# Altium schematic sheet TPS54528.schdoc
size 307 x 144 mm; SheetNumber: 1; SheetTotal: 1
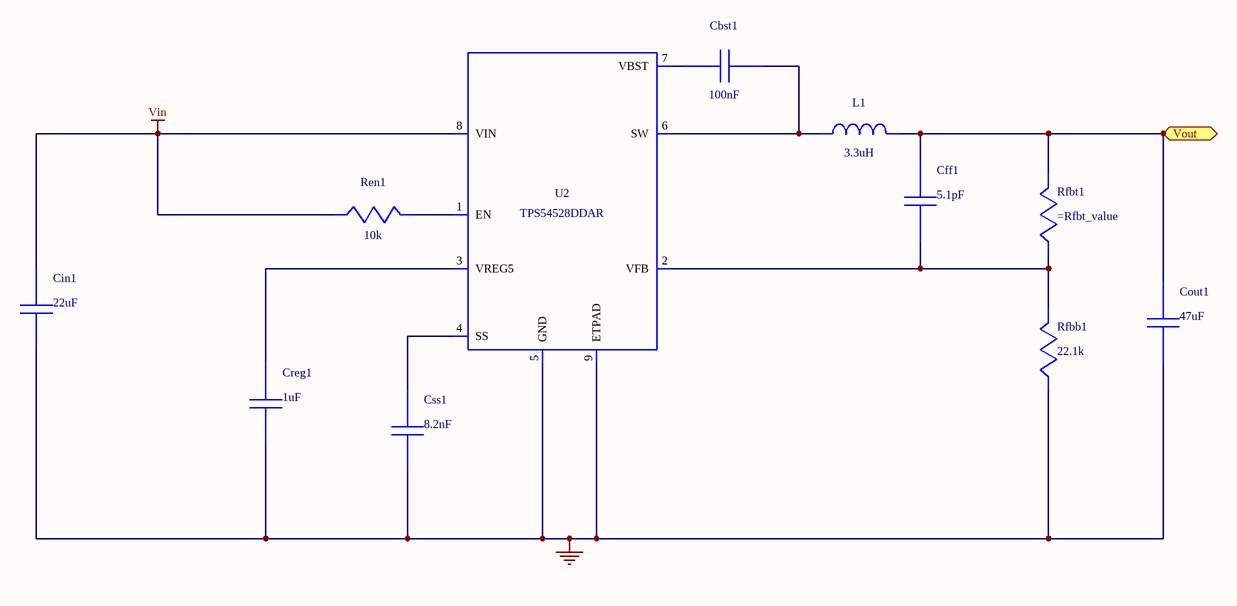
[diagram p0: TPS54528.schdoc]

## Parts
Cbst1  value 100nF  [AXIAL-0.3]  (hidden comment: C1005X5R1A104K)
Cff1  value 5.1pF  [AXIAL-0.3]  (hidden comment: GRM1555C1E5R1CA01D)
Cin1  value 22uF  [AXIAL-0.3]  (hidden comment: GRM32ER61E226KE15L)
Cout1  value 47uF  [AXIAL-0.3]  (hidden comment: GRM31CR61A476KE15L)
Creg1  value 1uF  [AXIAL-0.3]  (hidden comment: C1608X5R1A105K)
Css1  value 8.2nF  [AXIAL-0.3]  (hidden comment: GRM155R71E822KA01D)
L1  value 3.3uH  [Inductor]  (hidden comment: IHLP3232DZER3R3M11)
Ren1  value 10k  [AXIAL-0.3]  (hidden comment: CRCW040210K0FKED)
Rfbb1  value 22.1k  [AXIAL-0.3]  (hidden comment: CRCW040222K1FKED)
Rfbt1  CRCW0402121KFKED  [AXIAL-0.3]  (value not drawn)
U2  TPS54528DDAR  [DDA8_3P1X2P4]

## Ports
Vout (out)

## Nets
GND: Cin1.2 Cout1.2 Creg1.2 Css1.2 Rfbb1.2 U2.5(GND) U2.9(ETPAD)
Vin: Cin1.1 Ren1.2 U2.8(VIN)
Vout: Cff1.1 Cout1.1 L1.2 Rfbt1.1 ; port Vout
NetCbst1_1: Cbst1.1 U2.7(VBST)
NetCbst1_2: Cbst1.2 L1.1 U2.6(SW)
NetCff1_2: Cff1.2 Rfbb1.1 Rfbt1.2 U2.2(VFB)
NetCreg1_1: Creg1.1 U2.3(VREG5)
NetCss1_1: Css1.1 U2.4(SS)
NetRen1_1: Ren1.1 U2.1(EN)

## Library data of the parts
Cbst1 = C1005X5R1A104K: Manufacturer Name: TDK; PackageReference: C1005X5R1A104K; Manufacturer Part Number: C1005X5R1A104K
Cff1 = GRM1555C1E5R1CA01D: GRM1555C1E5R1CA0; Manufacturer Name: MuRata; PackageReference: GRM1555C1E5R1CA01D; Manufacturer Part Number: GRM1555C1E5R1CA01D
Cin1 = GRM32ER61E226KE15L: GRM32ER61E226KE1; Manufacturer Name: MuRata; PackageReference: GRM32ER61E226KE15L; Manufacturer Part Number: GRM32ER61E226KE15L
Cout1 = GRM31CR61A476KE15L: GRM31CR61A476KE1; Manufacturer Name: MuRata; PackageReference: GRM31CR61A476KE15L; Manufacturer Part Number: GRM31CR61A476KE15L
Creg1 = C1608X5R1A105K: Manufacturer Name: TDK; PackageReference: C1608X5R1A105K; Manufacturer Part Number: C1608X5R1A105K
Css1 = GRM155R71E822KA01D: GRM155R71E822KA0; Manufacturer Name: MuRata; PackageReference: GRM155R71E822KA01D; Manufacturer Part Number: GRM155R71E822KA01D
L1 = IHLP3232DZER3R3M11: Unknown; Manufacturer Name: Vishay-Dale; PackageReference: IHLP3232DZER3R3M11; Manufacturer Part Number: IHLP3232DZER3R3M11
Ren1 = CRCW040210K0FKED: Manufacturer Name: Vishay-Dale; PackageReference: CRCW040210K0FKED; Manufacturer Part Number: CRCW040210K0FKED
Rfbb1 = CRCW040222K1FKED: Manufacturer Name: Vishay-Dale; PackageReference: CRCW040222K1FKED; Manufacturer Part Number: CRCW040222K1FKED
Rfbt1 = CRCW0402121KFKED: Manufacturer Name: Vishay-Dale; PackageReference: CRCW0402121KFKED; Manufacturer Part Number: CRCW0402121KFKED; Value: =Rfbt_value
U2 = TPS54528DDAR: Manufacturer Name: Texas Instruments; Value: UNLISTED; PackageReference: TPS54528DDAR; Manufacturer Part Number: TPS54528DDAR